# EAGLE design BRAIN_Breakout (EAGLE 6.5.0)
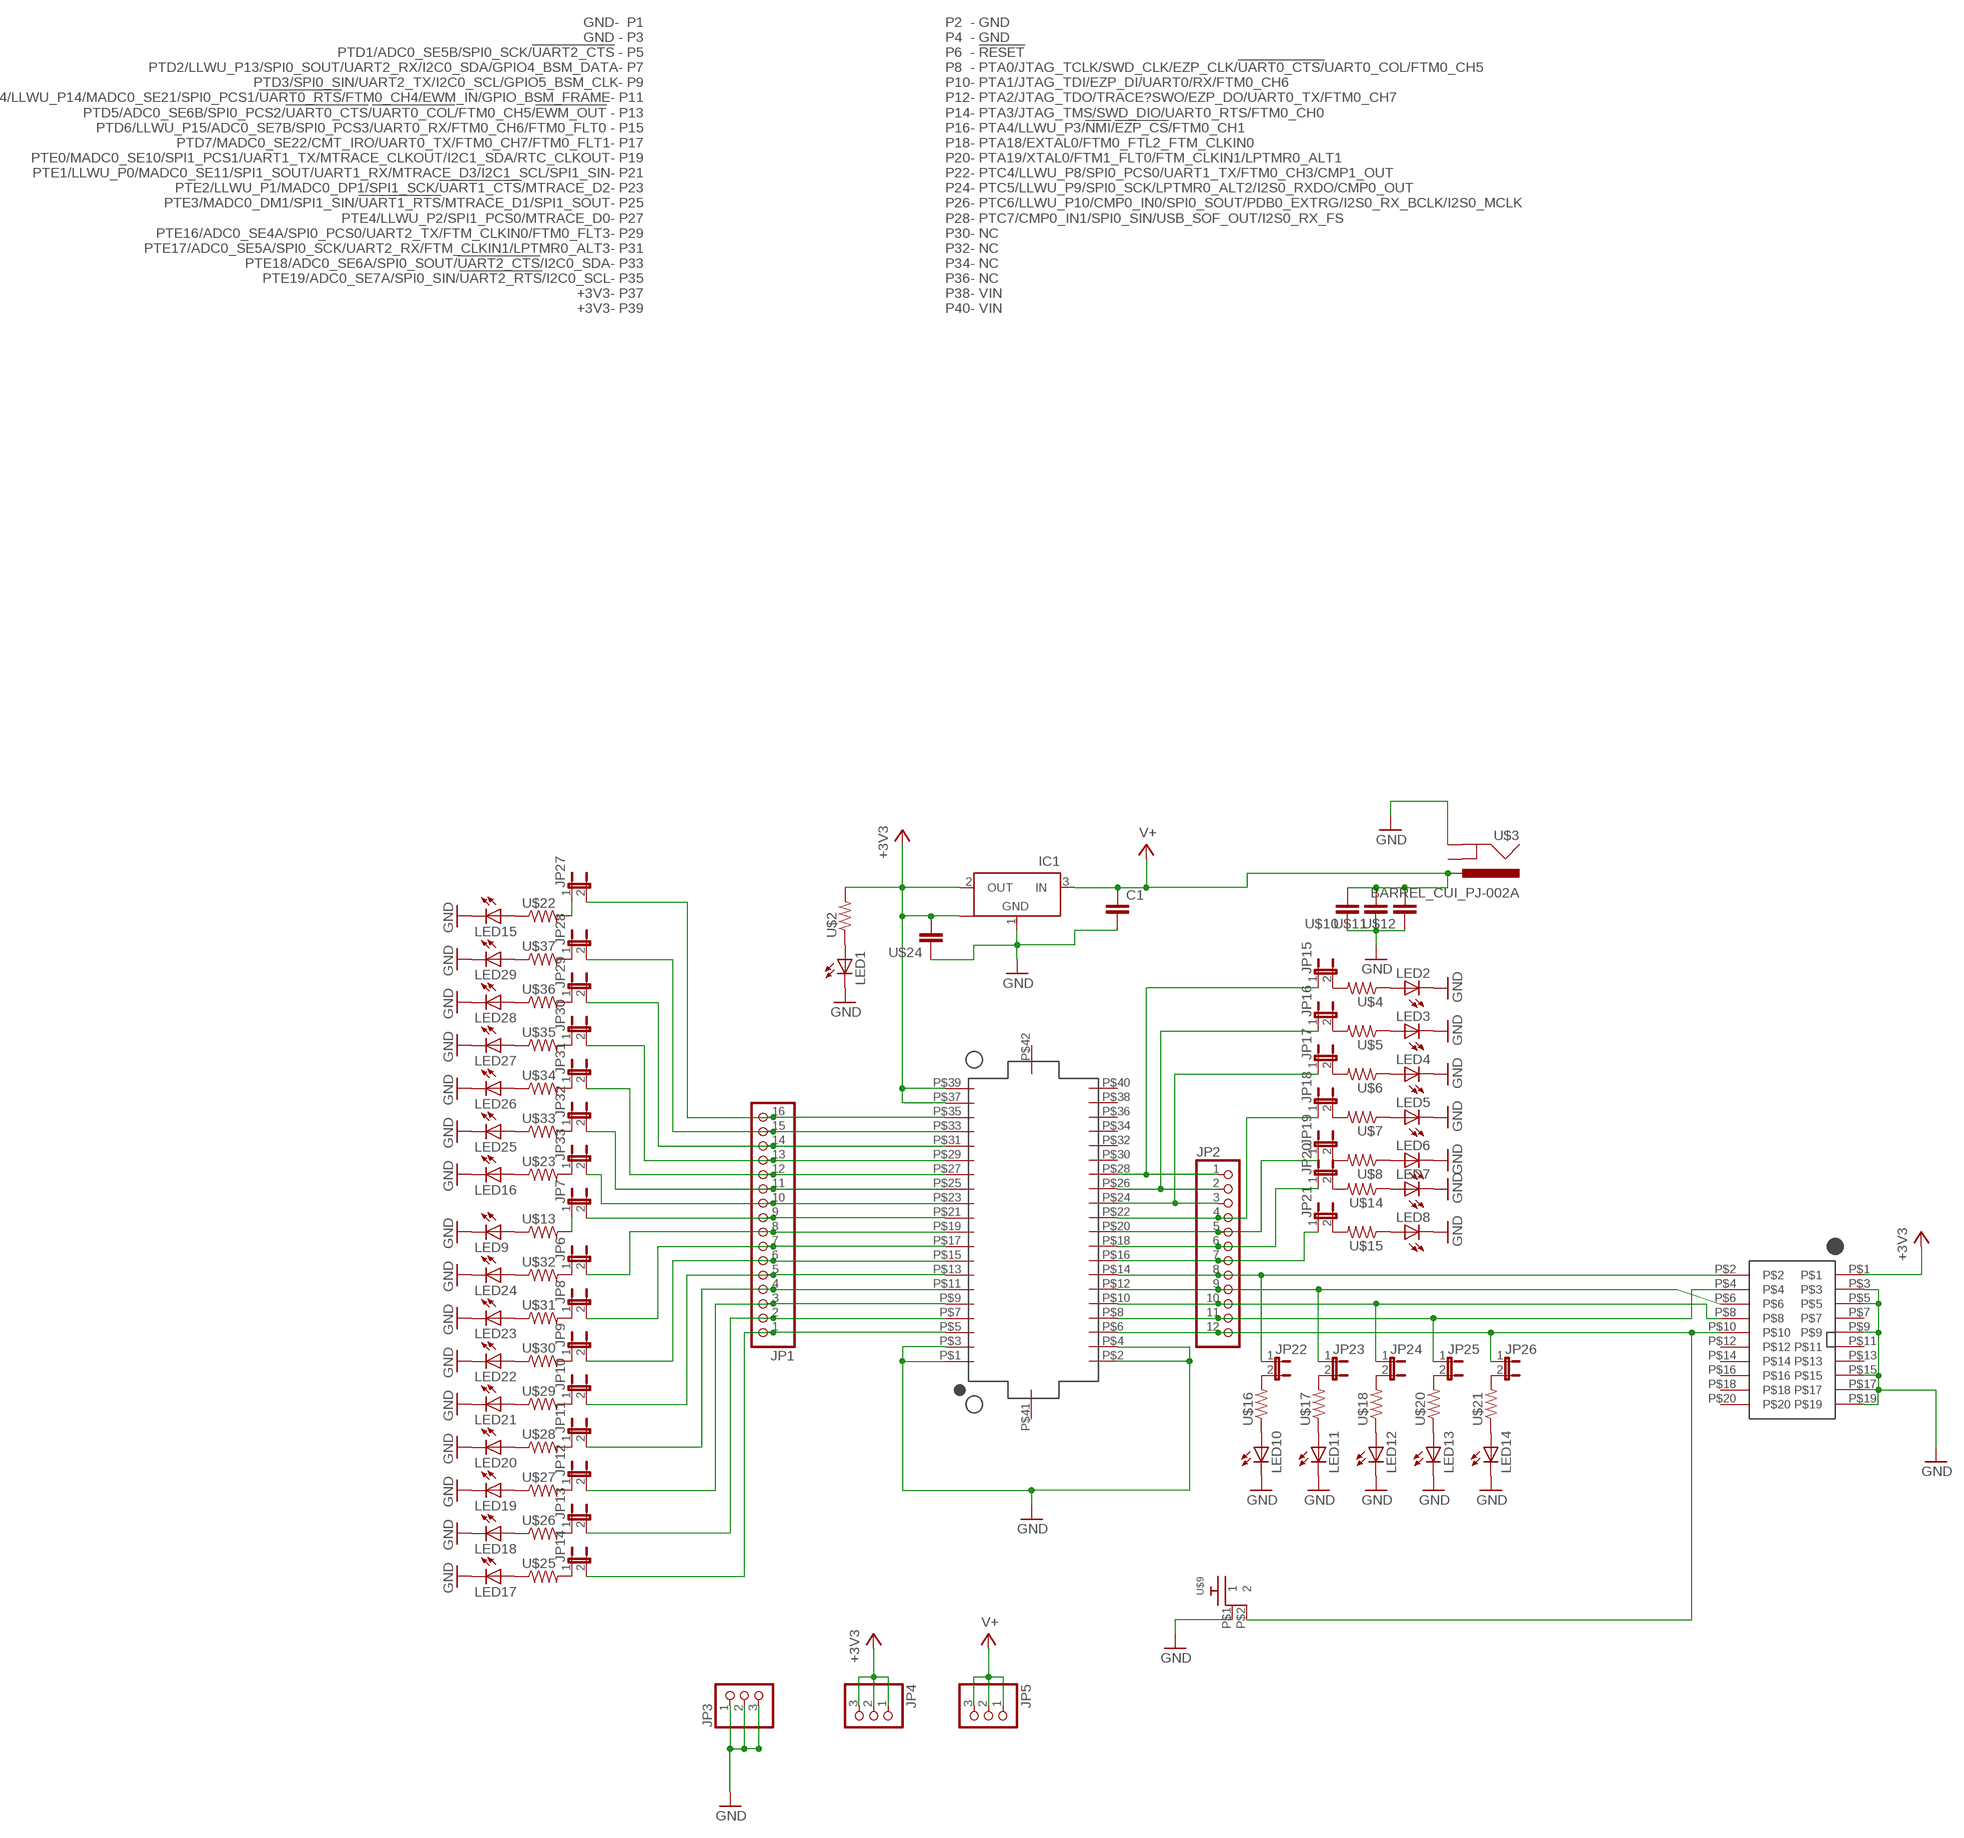
[diagram p0: schematic, sheet 1]

## Parts
C1  RF-C0805  [C0805]
IC1  NCP1117ST33T3G_1  [SOT223]
JP1  PINHD-1X16  [1X16]
JP2  PINHD-1X12  [1X12]
JP3  PINHD-1X3  [1X03]
JP4  PINHD-1X3  [1X03]
JP5  PINHD-1X3  [1X03]
JP6  JUMPER-2SMD-NO-NS  [SJ_2S-NO-NS]
JP7  JUMPER-2SMD-NO-NS  [SJ_2S-NO-NS]
JP8  JUMPER-2SMD-NO-NS  [SJ_2S-NO-NS]
JP9  JUMPER-2SMD-NO-NS  [SJ_2S-NO-NS]
JP10  JUMPER-2SMD-NO-NS  [SJ_2S-NO-NS]
JP11  JUMPER-2SMD-NO-NS  [SJ_2S-NO-NS]
JP12  JUMPER-2SMD-NO-NS  [SJ_2S-NO-NS]
JP13  JUMPER-2SMD-NO-NS  [SJ_2S-NO-NS]
JP14  JUMPER-2SMD-NO-NS  [SJ_2S-NO-NS]
JP15  JUMPER-2SMD-NO-NS  [SJ_2S-NO-NS]
JP16  JUMPER-2SMD-NO-NS  [SJ_2S-NO-NS]
JP17  JUMPER-2SMD-NO-NS  [SJ_2S-NO-NS]
JP18  JUMPER-2SMD-NO-NS  [SJ_2S-NO-NS]
JP19  JUMPER-2SMD-NO-NS  [SJ_2S-NO-NS]
JP20  JUMPER-2SMD-NO-NS  [SJ_2S-NO-NS]
JP21  JUMPER-2SMD-NO-NS  [SJ_2S-NO-NS]
JP22  JUMPER-2SMD-NO-NS  [SJ_2S-NO-NS]
JP23  JUMPER-2SMD-NO-NS  [SJ_2S-NO-NS]
JP24  JUMPER-2SMD-NO-NS  [SJ_2S-NO-NS]
JP25  JUMPER-2SMD-NO-NS  [SJ_2S-NO-NS]
JP26  JUMPER-2SMD-NO-NS  [SJ_2S-NO-NS]
JP27  JUMPER-2SMD-NO-NS  [SJ_2S-NO-NS]
JP28  JUMPER-2SMD-NO-NS  [SJ_2S-NO-NS]
JP29  JUMPER-2SMD-NO-NS  [SJ_2S-NO-NS]
JP30  JUMPER-2SMD-NO-NS  [SJ_2S-NO-NS]
JP31  JUMPER-2SMD-NO-NS  [SJ_2S-NO-NS]
JP32  JUMPER-2SMD-NO-NS  [SJ_2S-NO-NS]
JP33  JUMPER-2SMD-NO-NS  [SJ_2S-NO-NS]
LED1  LEDCHIP-LED0805  [CHIP-LED0805]
LED2  LEDCHIP-LED0805  [CHIP-LED0805]
LED3  LEDCHIP-LED0805  [CHIP-LED0805]
LED4  LEDCHIP-LED0805  [CHIP-LED0805]
LED5  LEDCHIP-LED0805  [CHIP-LED0805]
LED6  LEDCHIP-LED0805  [CHIP-LED0805]
LED7  LEDCHIP-LED0805  [CHIP-LED0805]
LED8  LEDCHIP-LED0805  [CHIP-LED0805]
LED9  LEDCHIP-LED0805  [CHIP-LED0805]
LED10  LEDCHIP-LED0805  [CHIP-LED0805]
LED11  LEDCHIP-LED0805  [CHIP-LED0805]
LED12  LEDCHIP-LED0805  [CHIP-LED0805]
LED13  LEDCHIP-LED0805  [CHIP-LED0805]
LED14  LEDCHIP-LED0805  [CHIP-LED0805]
LED15  LEDCHIP-LED0805  [CHIP-LED0805]
LED16  LEDCHIP-LED0805  [CHIP-LED0805]
LED17  LEDCHIP-LED0805  [CHIP-LED0805]
LED18  LEDCHIP-LED0805  [CHIP-LED0805]
LED19  LEDCHIP-LED0805  [CHIP-LED0805]
LED20  LEDCHIP-LED0805  [CHIP-LED0805]
LED21  LEDCHIP-LED0805  [CHIP-LED0805]
LED22  LEDCHIP-LED0805  [CHIP-LED0805]
LED23  LEDCHIP-LED0805  [CHIP-LED0805]
LED24  LEDCHIP-LED0805  [CHIP-LED0805]
LED25  LEDCHIP-LED0805  [CHIP-LED0805]
LED26  LEDCHIP-LED0805  [CHIP-LED0805]
LED27  LEDCHIP-LED0805  [CHIP-LED0805]
LED28  LEDCHIP-LED0805  [CHIP-LED0805]
LED29  LEDCHIP-LED0805  [CHIP-LED0805]
U$1  DF12_F  [DF12_F]
U$2  RF-R0805  [RF-C0805]
U$3  BARREL_CUI_PJ-002A  [BARREL_CUI_PJ-002A]
U$4  RF-R0805  [RF-C0805]
U$5  RF-R0805  [RF-C0805]
U$6  RF-R0805  [RF-C0805]
U$7  RF-R0805  [RF-C0805]
U$8  RF-R0805  [RF-C0805]
U$9  RA_BUTTON  [RA_BUTTON]
U$10  RF-C0805  [C0805]
U$11  RF-C0805  [C0805]
U$12  RF-C0805  [C0805]
U$13  RF-R0805  [RF-C0805]
U$14  RF-R0805  [RF-C0805]
U$15  RF-R0805  [RF-C0805]
U$16  RF-R0805  [RF-C0805]
U$17  RF-R0805  [RF-C0805]
U$18  RF-R0805  [RF-C0805]
U$19  2X10JTAG  [2X10JTAG]
U$20  RF-R0805  [RF-C0805]
U$21  RF-R0805  [RF-C0805]
U$22  RF-R0805  [RF-C0805]
U$23  RF-R0805  [RF-C0805]
U$24  RF-C0805  [C0805]
U$25  RF-R0805  [RF-C0805]
U$26  RF-R0805  [RF-C0805]
U$27  RF-R0805  [RF-C0805]
U$28  RF-R0805  [RF-C0805]
U$29  RF-R0805  [RF-C0805]
U$30  RF-R0805  [RF-C0805]
U$31  RF-R0805  [RF-C0805]
U$32  RF-R0805  [RF-C0805]
U$33  RF-R0805  [RF-C0805]
U$34  RF-R0805  [RF-C0805]
U$35  RF-R0805  [RF-C0805]
U$36  RF-R0805  [RF-C0805]
U$37  RF-R0805  [RF-C0805]

## Nets
+3V3: IC1.2(OUT) IC1.4(OUT1) JP4.1 JP4.2 JP4.3 U$1.P$37(+3V3) U$1.P$39(+3V3) U$2.2 U$19.P$1 U$24.2
GND: C1.2 IC1.1(GND) JP3.1 JP3.2 JP3.3 LED1.C LED2.C LED3.C LED4.C LED5.C LED6.C LED7.C LED8.C LED9.C LED10.C LED11.C LED12.C LED13.C LED14.C LED15.C LED16.C LED17.C LED18.C LED19.C LED20.C LED21.C LED22.C LED23.C LED24.C LED25.C LED26.C LED27.C LED28.C LED29.C U$1.P$1(GND) U$1.P$2(GND) U$1.P$3(GND) U$1.P$4(GND) U$3.P$2(GND) U$9.P$1 U$10.1 U$11.1 U$12.1 U$19.P$3 U$19.P$5 U$19.P$9 U$19.P$15 U$19.P$17 U$19.P$19 U$24.1
N$1: LED1.A U$2.1
N$2: LED2.A U$4.1
N$3: LED3.A U$5.1
N$4: LED4.A U$6.1
N$5: LED8.A U$15.1
N$6: LED5.A U$7.1
N$7: LED6.A U$8.1
N$8: LED7.A U$14.1
N$9: LED9.A U$13.1
N$10: JP7.1 U$13.2
N$11: JP21.2 U$15.2
N$12: JP20.2 U$14.2
N$13: JP19.2 U$8.2
N$14: JP18.2 U$7.2
N$15: JP17.2 U$6.2
N$16: JP16.2 U$5.2
N$17: JP15.2 U$4.2
N$18: JP6.1 U$32.2
N$19: JP8.1 U$31.2
N$20: JP9.1 U$30.2
N$21: JP2.1 JP15.1 U$1.P$28(PTC7/CMP0_IN1/SPI0_SIN/USB_SOF_OUT/I2S0_RX_FS)
N$22: JP2.2 JP16.1 U$1.P$26(PTC6/LLWU_P10/CMP0_IN0/SPI0_SOUT/PDB0_EXTRG/I2S0_RX_BCLK/I2S0_MCLK)
N$23: JP2.3 JP17.1 U$1.P$24(PTC5/LLWU_P8/SPI0_PCS0/UART1_TX/FTM0_CH3/CMP1_OUT)
N$24: JP2.4 JP18.1 U$1.P$22(PTC4/LLWU_P8/SPI0_PCS0/UART1_TX/FTM0_CH3/CMP1_OUT)
N$25: JP2.5 JP19.1 U$1.P$20(PTA19/XTAL0/FTM1_FLT0/FTM_CLKIN1/LPTMR0_ALT1)
N$26: JP2.6 JP20.1 U$1.P$18(PTA18/EXTAL0/FTM0_FTL2_FTM_CLKIN0)
N$27: JP2.7 JP21.1 U$1.P$16(PTA4/LLWU_P3/!NMI!/!EZP_CS!/FTM0_CH1)
N$28: LED15.A U$22.1
N$29: LED17.A U$25.1
N$30: LED18.A U$26.1
N$31: LED19.A U$27.1
N$32: LED20.A U$28.1
N$33: LED16.A U$23.1
N$34: LED25.A U$33.1
N$35: LED26.A U$34.1
N$36: LED27.A U$35.1
N$37: LED21.A U$29.1
N$38: LED22.A U$30.1
N$39: LED23.A U$31.1
N$40: LED24.A U$32.1
N$41: JP10.1 U$29.2
N$42: JP11.1 U$28.2
N$43: JP14.1 U$25.2
N$44: JP13.1 U$26.2
N$45: JP12.1 U$27.2
N$46: LED28.A U$36.1
N$48: JP2.8 JP22.1 U$1.P$14(PTA3/JTAG_TMS/SWD_DIO/UART0_RTS/FTM0_CH0) U$19.P$2
N$49: LED10.A U$16.1
N$50: JP22.2 U$16.2
N$51: JP2.9 JP23.1 U$1.P$12(PTA2/JTAG_TDO/TRACE?SWO/EZP_DO/UART0_TX/FTM0_CH7) U$19.P$6
N$52: LED11.A U$17.1
N$53: JP23.2 U$17.2
N$54: JP2.10 JP24.1 U$1.P$10(PTA1/JTAG_TDI/EZP_DI/UART0/RX/FTM0_CH6) U$19.P$8
N$55: LED12.A U$18.1
N$56: JP24.2 U$18.2
N$57: JP2.11 JP25.1 U$1.P$8(PTA0/JTAG_TCLK/SWD_CLK/EZP_CLK/!UART0_CTS/!UART0_COL/FTM0_CH5) U$19.P$4
N$58: LED13.A U$20.1
N$59: JP25.2 U$20.2
N$60: JP2.12 JP26.1 U$1.P$6(!RESET) U$9.P$2 U$19.P$10
N$61: LED14.A U$21.1
N$62: JP26.2 U$21.2
N$63: LED29.A U$37.1
N$64: JP27.1 U$22.2
N$65: JP28.1 U$37.2
N$66: JP29.1 U$36.2
N$67: JP30.1 U$35.2
N$68: JP31.1 U$34.2
N$69: JP32.1 U$33.2
N$70: JP33.1 U$23.2
PTD1: JP1.1 JP14.2 U$1.P$5(PTD1/ADC0_SE5B/SPI0_SCK/!UART2_CTS)
PTD2: JP1.2 JP13.2 U$1.P$7(PTD2/LLWU_P13/SPI0_SOUT/UART2_RX/I2C0_SDA/GPIO4_BSM_DATA)
PTD3: JP1.3 JP12.2 U$1.P$9(PTD3/SPI0_SIN/UART2_TX/I2C0_SCL/GPIO5_BSM_CLK)
PTD4: JP1.4 JP11.2 U$1.P$11(PTD4/LLWU_P14/MADC0_SE21/SPI0_PCS1/!UART0_RTS!/FTM0_CH4/EWM_IN/GPIO_BSM_FRAME)
PTD5: JP1.5 JP10.2 U$1.P$13(PTD5/ADC0_SE6B/SPI0_PCS2/!UART0_CTS!/!UART0_COL!/FTM0_CH5/!EWM_OUT)
PTD6: JP1.6 JP9.2 U$1.P$15(PTD6/LLWU_P15/ADC0_SE7B/SPI0_PCS3/UART0_RX/FTM0_CH6/FTM0_FLT0)
PTD7: JP1.7 JP8.2 U$1.P$17(PTD7/MADC0_SE22/CMT_IRO/UART0_TX/FTM0_CH7/FTM0_FLT1)
PTE0: JP1.8 JP6.2 U$1.P$19(PTE0/MADC0_SE10/SPI1_PCS1/UART1_TX/MTRACE_CLKOUT/I2C1_SDA/RTC_CLKOUT)
PTE1: JP1.9 JP7.2 U$1.P$21(PTE1/LLWU_P0/MADC0_SE11/SPI1_SOUT/UART1_RX/MTRACE_D3/I2C1_SCL/SPI1_SIN)
PTE2: JP1.10 JP33.2 U$1.P$23(PTE2/LLWU_P1/MADC0_DP1/SPI1_SCK/!UART1_CTS!/MTRACE_D2)
PTE3: JP1.11 JP32.2 U$1.P$25(PTE3/MADC0_DM1/SPI1_SIN/!UART1_RTS!/MTRACE_D1/SPI1_SOUT)
PTE4: JP1.12 JP31.2 U$1.P$27(PTE4/LLWU_P2/SPI1_PCS0/MTRACE_D0)
PTE16: JP1.13 JP30.2 U$1.P$29(PTE16/ADC0_SE4A/SPI0_PCS0/UART2_TX/FTM_CLKIN0/FTM0_FLT3)
PTE17: JP1.14 JP29.2 U$1.P$31(PTE17/ADC0_SE5A/SPI0_SCK/UART2_RX/FTM_CLKIN1/LPTMR0_ALT3)
PTE18: JP1.15 JP28.2 U$1.P$33(PTE18/ADC0_SE6A/SPI0_SOUT/!UART2_CTS!/I2C0_SDA)
PTE19: JP1.16 JP27.2 U$1.P$35(PTE19/ADC0_SE7A/SPI0_SIN/!UART2_RTS!/I2C0_SCL)
V+: C1.1 IC1.3(IN) JP5.1 JP5.2 JP5.3 U$3.P$1(PWR) U$10.2 U$11.2 U$12.2
Unconnected: U$1.P$30(NC) U$1.P$32(NC) U$1.P$34(NC) U$1.P$36(NC) U$1.P$38(VIN) U$1.P$40(VIN) U$1.P$41 U$1.P$42 U$3.P$3(GNDBREAK) U$19.P$7 U$19.P$11 U$19.P$12 U$19.P$13 U$19.P$14 U$19.P$16 U$19.P$18 U$19.P$20

## Library data of the parts
C1 U$10-U$12 U$24 = GW-devices:RF-C: RF capacitor pads for FSL reference design
IC1 = KW2:NCP1117ST33T3G_1: VOLTAGE REGULATOR; MFGN: OnSemi; MFGP: NCP1117ST33T3G
JP1 = pinhead:PINHD-1X16: PIN HEADER
JP2 = pinhead:PINHD-1X12: PIN HEADER
JP3-JP5 = pinhead:PINHD-1X3: PIN HEADER
JP6-JP33 = SparkFun:JUMPER-2: Jumper Basic 0.1" spaced jumper. Use with breakaway headers.
LED1-LED14 LED16-LED27 LED29 = adafruit:LED: LED OSRAM: - CHIPLED LG R971, LG N971, LY N971, LG Q971, LY Q971, LO R971, LY R971 LH N974, LH R974 LS Q976, LO Q976, LY Q976 LO Q996 - Hyper CHIPLED LW Q18S LB Q993, LB Q99A, LB R99A - SideLED LS A670, LO A670, LY A670, LG A670, LP A670 LB A673, LV A673, LT A673, LW A673 LH A674 LY A675 LS A676, LA A676, LO A676, LY A676, LW A676 LS A679, LY A679, LG A679 - Hyper Micro SIDELED® LS Y876, LA Y876, LO Y876, LY Y876 LT Y87S - SmartLED LW L88C, LW L88S LB L89C, LB L89S, LG L890 LS L89K, LO L89K, LY L89K LS L896, LA L896, LO L896, LY L896 - TOPLED LS T670, LO T670, LY T670, LG T670, LP T670 LSG T670, LSP T670, LSY T670, LOP T670, LYG T670 LG T671, LOG T671, LSG T671 LB T673, LV T673, LT T673, LW T673 LH T674 LS T676, LA T676, LO T676, LY T676, LB T676, LH T676, LSB T676, LW T676 LB T67C, LV T67C, LT T67C, LS T67K, LO T67K, LY T67K, LW E67C LS E67B, LA E67B, LO E67B, LY E67B, LB E67C, LV E67C, LT E67C LW T67C LS T679, LY T679, LG T679 LS T770, LO T770, LY T770, LG T770, LP T770 LB T773, LV T773, LT T773, LW T773 LH T774 LS E675, LA E675, LY E675, LS T675 LS T776, LA T776, LO T776, LY T776, LB T776 LHGB T686 LT T68C, LB T68C - Hyper Mini TOPLED® LB M676 - Mini TOPLED Santana® LG M470 LS M47K, LO M47K, LY M47K Source: http://www.osram.convergy.de/
LED15 LED28 = adafruit:LED: LED OSRAM: - CHIPLED LG R971, LG N971, LY N971, LG Q971, LY Q971, LO R971, LY R971 LH N974, LH R974 LS Q976, LO Q976, LY Q976 LO Q996 - Hyper CHIPLED LW Q18S LB Q993, LB Q99A, LB R99A - SideLED LS A670, LO A670, LY A670, LG A670, LP A670 LB A673, LV A673, LT A673, LW A673 LH A674 LY A675 LS A676, LA A676, LO A676, LY A676, LW A676 LS A679, LY A679, LG A679 - Hyper Micro SIDELED® LS Y876, LA Y876, LO Y876, LY Y876 LT Y87S - SmartLED LW L88C, LW L88S LB L89C, LB L89S, LG L890 LS L89K, LO L89K, LY L89K LS L896, LA L896, LO L896, LY L896 - TOPLED LS T670, LO T670, LY T670, LG T670, LP T670 LSG T670, LSP T670, LSY T670, LOP T670, LYG T670 LG T671, LOG T671, LSG T671 LB T673, LV T673, LT T673, LW T673 LH T674 LS T676, LA T676, LO T676, LY T676, LB T676, LH T676, LSB T676, LW T676 LB T67C, LV T67C, LT T67C, LS T67K, LO T67K, LY T67K, LW E67C LS E67B, LA E67B, LO E67B, LY E67B, LB E67C, LV E67C, LT E67C LW T67C LS T679, LY T679, LG T679 LS T770, LO T770, LY T770, LG T770, LP T770 LB T773, LV T773, LT T773, LW T773 LH T774 LS E675, LA E675, LY E675, LS T675 LS T776, LA T776, LO T776, LY T776, LB T776 LHGB T686 LT T68C, LB T68C - Hyper Mini TOPLED® LB M676 - Mini TOPLED Santana® LG M470 LS M47K, LO M47K, LY M47K Source: http://www.osram.convergy.de/; MFGN: Kingbright
U$1 = KW2:DF12_F
U$2 U$4-U$8 U$13-U$18 U$20-U$23 U$25-U$37 = GW-devices:RF-R: RF resistor pads for FSL reference design
U$3 = KW2:BARREL_CUI_PJ-002A
U$9 = KW2:RA_BUTTON; MFGN: TE; MFGP: 1825027-5
U$19 = KW2:2X10JTAG

## Board
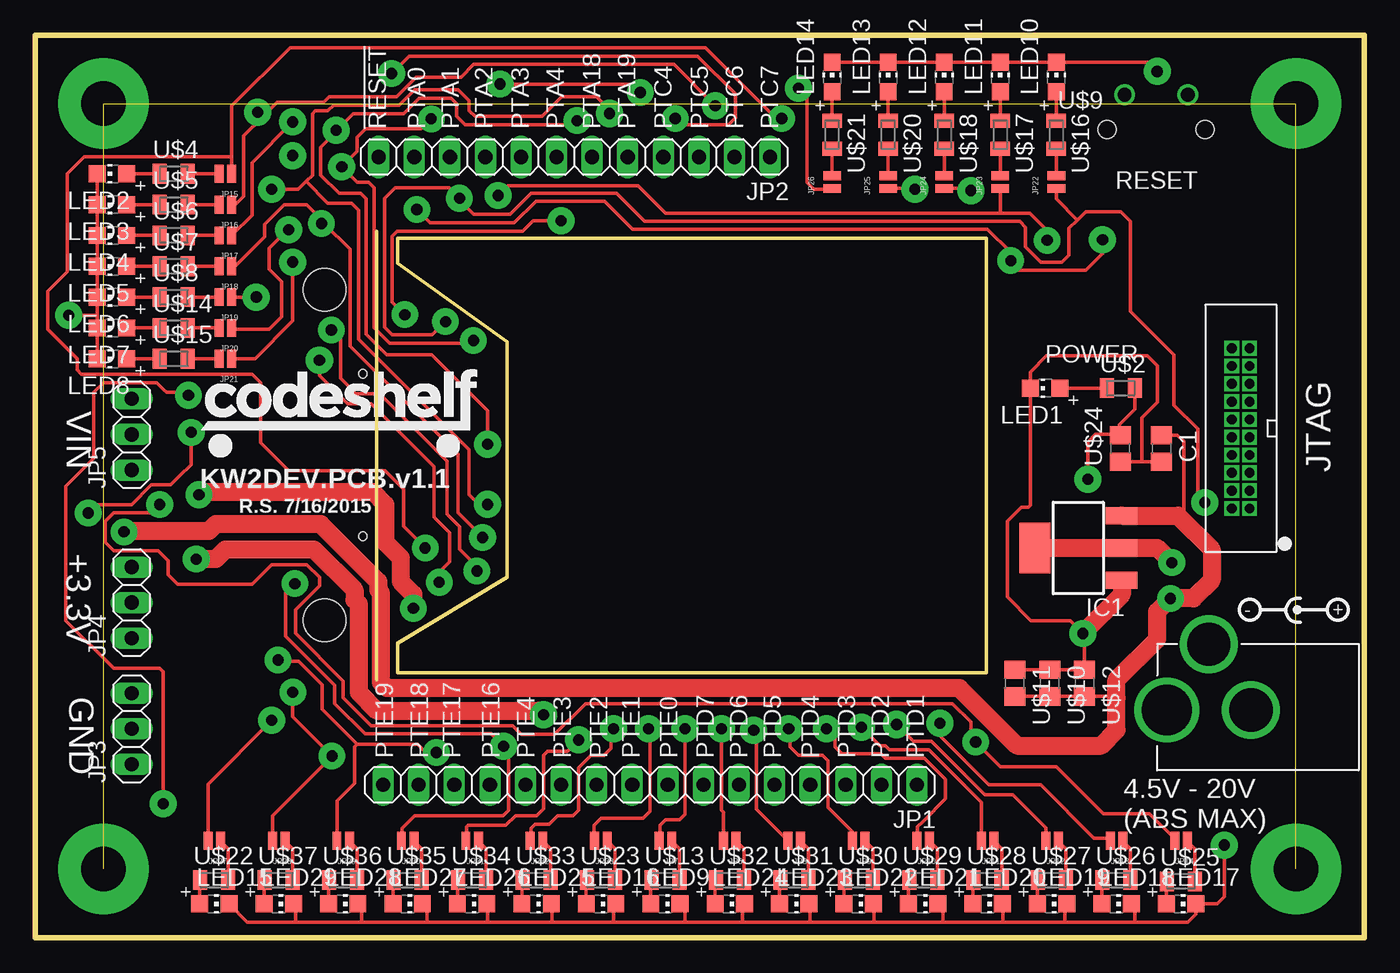
[diagram p1: board, top side]
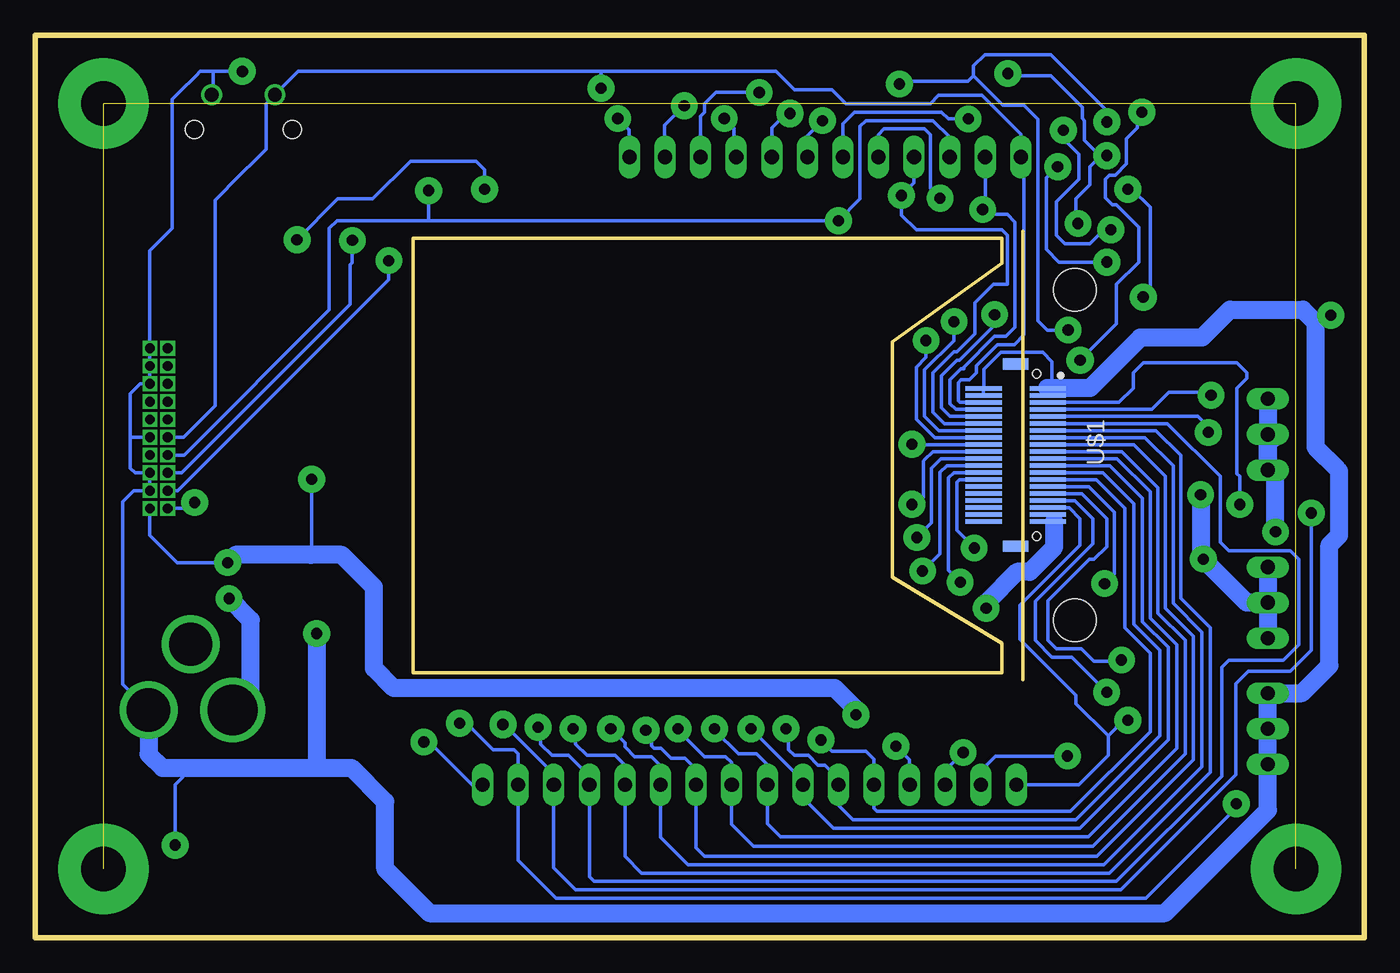
[diagram p2: board, bottom side, seen from below]

Size 94.9 x 64.4 mm. Coordinates in mm from the lower left corner, seen from the top.
Outline: 0,64.4 94.9,64.4 94.9,0 0,0 0,64.4
Copper layers (1*16): Top 0.035mm / dielectric 1.5mm / Bottom 0.035mm
Design rules "default *": minimum track width 10mil, minimum drill 0.8mm, track to track 0.25mm, track to pad 0.25mm, pad to pad 0.25mm, via to via 0.25mm, smd to smd 0.25mm, copper to edge 0.1mm, drill to drill 0.1mm, minimum pad ring 0.1mm, minimum via ring 0.55mm, stop-mask expansion 4mil, vias tented up to drill 0.8mm, thermal gap 10mil

### Footprints (pad centres in the part's own frame; a part is rotated, then mirrored left to right if it is on the bottom)
C0805 = smd 1.3 x 1.5: 1 -0.95,0; 2 0.95,0
SOT223 = smd 1.219 x 2.235: 1 -2.311,-3.099; 2 0,-3.099; 3 2.311,-3.099 | smd 3.6 x 2.2: 4 0,3.099
1X16 = drill 1.016 long: 1 -19.05,0; 2 -16.51,0; 3 -13.97,0; 4 -11.43,0; 5 -8.89,0; 6 -6.35,0; 7 -3.81,0; 8 -1.27,0; 9 1.27,0; 10 3.81,0; 11 6.35,0; 12 8.89,0; 13 11.43,0; 14 13.97,0; 15 16.51,0; 16 19.05,0
1X12 = drill 1.016 long: 1 -13.97,0; 2 -11.43,0; 3 -8.89,0; 4 -6.35,0; 5 -3.81,0; 6 -1.27,0; 7 1.27,0; 8 3.81,0; 9 6.35,0; 10 8.89,0; 11 11.43,0; 12 13.97,0
1X03 = drill 1.016 long: 1 -2.54,0; 2 0,0; 3 2.54,0
SJ_2S-NO-NS = smd 0.635 x 1.27: 1 -0.45,0; 2 0.45,0
CHIP-LED0805 = smd 1.2 x 1.2: A 0,-1.05; C 0,1.05
DF12_F = smd 0.3 x 2.6: P$1 -4.75,2.3; P$2 -4.75,-2.3; P$3 -4.25,2.3; P$4 -4.25,-2.3; P$5 -3.75,2.3; P$6 -3.75,-2.3; P$7 -3.25,2.3; P$8 -3.25,-2.3; P$9 -2.75,2.3; P$10 -2.75,-2.3; P$11 -2.25,2.3; P$12 -2.25,-2.3; P$13 -1.75,2.3; P$14 -1.75,-2.3; P$15 -1.25,2.3; P$16 -1.25,-2.3; P$17 -0.75,2.3; P$18 -0.75,-2.3; P$19 -0.25,2.3; P$20 -0.25,-2.3; P$21 0.25,2.3; P$22 0.25,-2.3; P$23 0.75,2.3; P$24 0.75,-2.3; P$25 1.25,2.3; P$26 1.25,-2.3; P$27 1.75,2.3; P$28 1.75,-2.3; P$29 2.25,2.3; P$30 2.25,-2.3; P$31 2.75,2.3; P$32 2.75,-2.3; P$33 3.25,2.3; P$34 3.25,-2.3; P$35 3.75,2.3; P$36 3.75,-2.3; P$37 4.25,2.3; P$38 4.25,-2.3; P$39 4.75,2.3; P$40 4.75,-2.3 | smd 0.8 x 1.8: P$41 -6.5,0; P$42 6.5,0 | hole 0.6: -5.8,1.5; 5.8,1.5 | hole 3.048: -11.8,4.24; 11.8,4.24
RF-C0805 = smd 1 x 1.4: 1 -1,0; 2 1,0
BARREL_CUI_PJ-002A = drill 3.6: P$1 0,0 | drill 3.1: P$2 6,0; P$3 3,4.7
RA_BUTTON = drill 0.99: P$1 -2.25,0; P$2 2.25,0 | hole 1.3: -3.501,2.49; 3.501,2.49
2X10JTAG = drill 0.7 pad 1 square: P$1 -6.35,-1.27; P$2 -6.35,0; P$3 -5.08,-1.27; P$4 -5.08,0; P$5 -3.81,-1.27; P$6 -3.81,0; P$7 -2.54,-1.27; P$8 -2.54,0; P$9 -1.27,-1.27; P$10 -1.27,0; P$11 0,-1.27; P$12 0,0; P$13 1.27,-1.27; P$14 1.27,0; P$15 2.54,-1.27; P$16 2.54,0; P$17 3.81,-1.27; P$18 3.81,0; P$19 5.08,-1.27; P$20 5.08,0

### Placement (x,y rotation side)
C1  80.4,34.9 270 top
IC1  74.47,27.8 90 top
JP1  43.9,10.9 180 top
JP2  38.5,55.7 180 top
JP3  6.9,14.9 90 top
JP4  6.9,23.9 90 top
JP5  6.9,35.9 90 top
JP6  49.6,6.9 180 top
JP7  45,6.9 180 top
JP8  54.2,6.9 180 top
JP9  58.8,6.9 180 top
JP10  63.4,6.9 180 top
JP11  68,6.9 180 top
JP12  72.6,6.9 180 top
JP13  77.2,6.9 180 top
JP14  81.8,6.9 180 top
JP15  13.6,54.5 180 top
JP16  13.6,52.3 180 top
JP17  13.6,50.1 180 top
JP18  13.6,47.9 180 top
JP19  13.6,45.7 180 top
JP20  13.6,43.5 180 top
JP21  13.6,41.3 180 top
JP22  72.9,53.9 90 top
JP23  68.9,53.9 90 top
JP24  64.9,53.9 90 top
JP25  60.9,53.9 90 top
JP26  56.9,53.9 90 top
JP27  12.8,6.9 180 top
JP28  17.4,6.9 180 top
JP29  22,6.9 180 top
JP30  26.6,6.9 180 top
JP31  31.2,6.9 180 top
JP32  35.8,6.9 180 top
JP33  40.4,6.9 180 top
LED1  72.1,39.2 90 top
LED2  5.5,54.5 90 top
LED3  5.5,52.3 90 top
LED4  5.5,50.1 90 top
LED5  5.5,47.9 90 top
LED6  5.5,45.7 90 top
LED7  5.5,43.5 90 top
LED8  5.5,41.3 90 top
LED9  45,2.4 270 top
LED10  72.9,61.4 0 top
LED11  68.9,61.4 0 top
LED12  64.9,61.4 0 top
LED13  60.9,61.4 0 top
LED14  56.9,61.4 0 top
LED15  12.8,2.4 270 top
LED16  40.4,2.4 270 top
LED17  81.8,2.4 270 top
LED18  77.2,2.4 270 top
LED19  72.6,2.4 270 top
LED20  68,2.4 270 top
LED21  63.4,2.4 270 top
LED22  58.8,2.4 270 top
LED23  54.2,2.4 270 top
LED24  49.6,2.4 270 top
LED25  35.8,2.4 270 top
LED26  31.2,2.4 270 top
LED27  26.6,2.4 270 top
LED28  22,2.4 270 top
LED29  17.4,2.4 270 top
U$1  24.9,34.43 270 bottom
U$2  77.5,39.2 0 top
U$3  80.79,16.23 0 top
U$4  9.9,54.5 0 top
U$5  9.9,52.3 0 top
U$6  9.9,50.1 0 top
U$7  9.9,47.9 0 top
U$8  9.9,45.7 0 top
U$9  80.03,60.14 180 top
U$10  72.43,18.15 270 top
U$11  69.94,18.15 270 top
U$12  74.92,18.15 270 top
U$13  45,4.1 0 top
U$14  9.9,43.5 0 top
U$15  9.9,41.3 0 top
U$16  72.9,57.3 270 top
U$17  68.9,57.3 270 top
U$18  64.9,57.3 270 top
U$19  85.43,36.97 90 top
U$20  60.9,57.3 270 top
U$21  56.9,57.3 270 top
U$22  12.8,4.1 0 top
U$23  40.4,4.1 0 top
U$24  77.46,34.9 90 top
U$25  81.8,4 0 top
U$26  77.2,4.1 0 top
U$27  72.6,4.1 0 top
U$28  68,4.1 0 top
U$29  63.4,4.1 0 top
U$30  58.8,4.1 0 top
U$31  54.2,4.1 0 top
U$32  49.6,4.1 0 top
U$33  35.8,4.1 0 top
U$34  31.2,4.1 0 top
U$35  26.6,4.1 0 top
U$36  22,4.1 0 top
U$37  17.4,4.1 0 top

### Tracks (layer width: path | path; a pad name or v marks a point on that pad's centre or on a via)
+3V3  (via drill 0.8)
  Top 0.254: U$2.2 78.5,37.7 77.4,36.6 77.4,35.91 U$24.2 77.41,35.9 75.7,35.9 75.15,35.35 v75.15,32.7
  Top 1.27: v11.5,27 12.9,27 13.6,27.7 19.9,27.7 22.8,24.8 22.8,24.1 23.1,23.8 23.1,17.5 24.4,16.2 36,16.2 v36.3,15.9 | v81.15,26.75 80.1,27.8 IC1.2 IC1.4 | v11.7,31.6 11.9,31.8 24.1,31.8 25,30.9 25,28.2 26.1,27.1 26.1,25.4 27,24.5 v27,23.5
  Bottom 0.254: U$1.P$37 U$1.P$39 22.58,29.7 22.15,29.7 | 80.97,26.88 81.03,26.88 v81.15,26.75 84.75,26.75 86.7,28.7 U$19.P$1 | v75.15,32.7 75.15,27.35 75.2,27.3
  Bottom 1.27: 81.05,26.8 80.97,26.88 | 22.15,29.7 22.15,27.85 23.9,26.1 24.8,26.1 27,23.9 v27,23.5 | JP4.3 JP4.2 | JP4.2 JP4.1 | v81.15,26.75 80.6,27.3 75.2,27.3 73,27.3 70.7,25 70.7,19.2 69.3,17.8 37.8,17.8 36.3,16.3 v36.3,15.9 | JP4.2 8.4,23.9 v11.5,27 11.7,27.2 v11.7,31.6
GND  (via drill 0.8, 0.8 pad 1.93)
  Top 0.254: U$24.1 79,33.95 | 79,33.95 C1.2 | U$11.1 U$10.1 U$12.1 74.92,21.58 v74.8,21.7 73.9,22.6 71.1,22.6 69.4,24.3 69.4,29.7 70.4,30.7 70.9,30.7 71.05,30.85 LED1.C 71.05,40.35 72.2,41.5 79.4,41.5 80.1,40.8 80.1,38.2 79,37.1 79,33.95 | LED14.C LED13.C LED12.C LED11.C LED10.C 75.95,62.45 79.45,62.45 v80.1,61.8 | v2.4,44.4 4.45,44.4 | LED2.C LED3.C LED4.C LED5.C LED6.C 4.45,44.4 | 4.45,44.4 LED7.C LED8.C | LED15.C 15.15,1.1 18.6,1.1 | 18.6,1.1 23.3,1.1 | 23.3,1.1 28,1.1 | 28,1.1 32.3,1.1 | 32.3,1.1 36.9,1.1 | 36.9,1.1 41.3,1.1 | 41.3,1.1 46.4,1.1 | 46.4,1.1 50.5,1.1 | 50.5,1.1 55.3,1.1 | 55.3,1.1 59.9,1.1 | 59.9,1.1 64.8,1.1 | 64.8,1.1 69.1,1.1 | 69.1,1.1 73.5,1.1 | 73.5,1.1 78.5,1.1 | 78.5,1.1 82.3,1.1 82.85,1.65 LED17.C 84.4,2.4 84.9,2.9 v84.9,6.6 | LED18.C 78.5,2.15 78.5,1.1 | LED19.C 73.5,2.25 73.5,1.1 | LED20.C 69.1,2.35 69.1,1.1 | LED21.C 64.8,2.05 64.8,1.1 | LED22.C 59.9,2.35 59.9,1.1 | LED23.C 55.3,2.35 55.3,1.1 | LED24.C 50.5,2.25 50.5,1.1 | LED9.C 46.4,2.05 46.4,1.1 | LED16.C 41.3,2.25 41.3,1.1 | LED25.C 36.9,2.35 36.9,1.1 | LED26.C 32.3,2.35 32.3,1.1 | LED29.C 18.6,2.25 18.6,1.1 | LED28.C 23.3,2.15 23.3,1.1 | LED27.C 28,2.05 28,1.1
  Top 1.27: IC1.1 77.57,24.47 v74.8,21.7
  Bottom 0.254: U$1.P$4 U$1.P$2 27.15,39.23 27.15,40.55 25.95,41.75 22.95,41.75 22.3,41.1 22.3,39.48 U$1.P$1 | U$1.P$3 U$1.P$1 | U$1.P$1 22.65,39.23 | 3.5,43.9 2.9,43.9 v2.4,44.4 | U$3.P$2 88.65,18.09 88.65,31.1 87.86,31.89 U$19.P$3 U$19.P$5 87.76,33.16 88.1,33.5 88.1,35.6 | 83.2,11.9 83.4,12.1 | U$19.P$9 88,35.7 88.1,35.6 | 88.1,35.6 88.1,38.8 87.4,39.5 U$19.P$15 U$19.P$17 U$19.P$19 86.7,49 85.1,50.6 85.1,56.2 85.1,59.8 84.6,60.3 83.4,61.5 83.1,61.8 82.2,61.8 | 83.7,12.1 84.9,10.9 v84.9,6.6 | 82.2,61.8 v80.1,61.8 | U$9.P$1 82.2,60.22 82.2,61.8
  Bottom 1.016: 1.8,33.3 1.95,33.45
  Bottom 1.27: 22.65,39.23 19.57,39.23 16,42.8 11.6,42.8 9.6,44.8 4.4,44.8 3.5,43.9 3.5,35 1.95,33.45 | U$3.P$2 86.79,13.09 85.8,12.1 83.7,12.1 83.4,12.1 74.7,12.1 | 74.7,12.1 72.31,12.1 69.9,9.69 69.9,4.9 66.75,1.75 14.25,1.75 6.9,9.1 JP3.1 JP3.2 JP3.3 4.46,17.44 2.5,19.4 2.5,28 1.8,28.7 1.8,33.3 | v74.8,21.7 74.8,12.2 74.7,12.1
N$1
  Top 0.254: LED1.A U$2.1
N$2
  Top 0.254: LED2.A U$4.1
N$3
  Top 0.254: LED3.A U$5.1
N$4
  Top 0.254: LED4.A U$6.1
N$5
  Top 0.254: LED8.A U$15.1
N$6
  Top 0.254: LED5.A U$7.1
N$7
  Top 0.254: LED6.A U$8.1
N$8
  Top 0.254: LED7.A U$14.1
N$9
  Top 0.254: U$13.1 43.95,4.05 LED9.A
N$10
  Top 0.254: U$13.2 46,5.35 46,6.35 JP7.1
N$11
  Top 0.254: U$15.2 JP21.2
N$12
  Top 0.254: U$14.2 JP20.2
N$13
  Top 0.254: U$8.2 JP19.2
N$14
  Top 0.254: U$7.2 JP18.2
N$15
  Top 0.254: U$6.2 JP17.2
N$16
  Top 0.254: U$5.2 JP16.2
N$17
  Top 0.254: U$4.2 JP15.2
N$18
  Top 0.254: U$32.2 50.6,5.35 50.6,6.35 JP6.1
N$19
  Top 0.254: U$31.2 55.2,5.35 55.2,6.35 JP8.1
N$20
  Top 0.254: U$30.2 59.8,5.35 59.8,6.35 JP9.1
N$21  (via drill 0.8)
  Top 0.254: v27.85,27.8 26.3,29.35 26.3,32 25,33.3 18.1,33.3 16.1,35.3 16.1,39.6 15.5,40.2 3.3,40.2 3,40.5 3,41.3 0.9,43.4 0.9,46.1 2.3,47.5 2.3,54.5 3.5,55.7 14.05,55.7 | JP15.1 14.05,55.7 | 14.05,55.7 14.05,59.35 18.2,63.5 47.85,63.5 52.5,58.85 52.9,58.85 v53.3,58.45
  Bottom 0.254: U$1.P$28 28.92,32.68 29.1,32.5 29.1,29.05 v27.85,27.8 | JP2.1 52.5,55.73 52.5,57.65 v53.3,58.45
N$22  (via drill 0.8, 0.8 pad 1.93)
  Top 0.254: v28.85,25.35 28.85,26.05 29.6,26.8 29.6,28.9 28.5,30 28.5,33.6 24,38.1 22.3,38.1 20.3,40.1 v20.3,41.2 | 16.25,58.55 14.9,57.2 14.9,52.9 14.3,52.3 JP16.1 | 16.25,58.55 17.3,59.6 20.6,59.6 21,60 25.8,60 27.2,61.4 30.4,61.4 31.3,62.3 45.6,62.3 v48.55,59.35 | v15.9,58.9 16.25,58.55
  Bottom 0.254: U$1.P$26 29.32,33.18 29.7,32.8 29.7,26.2 v28.85,25.35 | JP2.2 49.95,55.72 49.95,57.95 v48.55,59.35 | v15.9,58.9 16.2,58.6 16.2,57.8 17,57 17,55.2 17.8,54.4 18.2,54.4 18.5,54.1 18.5,52.8 18,52.3 17.7,52.3 16.1,50.7 16.1,48.2 17.7,46.6 17.7,43.8 v20.3,41.2
N$23  (via drill 0.8, 0.8 pad 1.93)
  Top 0.254: v43.2,60.3 42.6,60.9 v33.2,60.9 | v31.55,26.15 31.55,26.45 30.3,27.7 30.3,29.3 29.4,30.2 29.4,34 24.6,38.8 22.9,38.8 21.8,39.9 21.8,42.7 v21.15,43.35 | JP17.1 15.5,51.55 15.5,55.3 v18.4,58.2
  Bottom 0.254: v43.2,60.3 46.3,60.3 47.1,59.5 47.1,58.9 47.39,58.61 47.39,58.31 JP2.3 | U$1.P$24 29.82,33.68 30.3,33.2 30.3,27.4 v31.55,26.15 | v18.4,58.2 18.4,59 22.4,63 27.1,63 27.9,62.2 27.9,61.5 | v21.15,43.35 22.65,43.35 23.3,44 23.3,58.4 24.3,59.4 25.8,59.4 27.9,61.5 | 27.9,61.5 28.3,61.1 33,61.1 v33.2,60.9
N$24  (via drill 0.8, 0.8 pad 1.93)
  Top 0.254: v31.95,28.55 30.2,30.3 30.2,34.5 22.5,42.2 22.5,49.1 20.65,50.95 v20.45,50.95 20.45,51.25 19.4,52.3 17.8,52.3 16.4,50.9 16.4,50 14.3,47.9 JP18.1 | v45.7,58.45 46.15,58 49.5,58 50,58.5 50,60.2 47.3,62.9 26.7,62.9 v25.45,61.65
  Bottom 0.254: U$1.P$22 30.22,34.18 30.9,33.5 30.9,29.6 v31.95,28.55 | JP2.4 45,55.85 45,57.75 v45.7,58.45 | 18.9,55.8 20,56.9 20,58.3 20.15,58.45 20.15,59.25 22.4,61.5 25.3,61.5 v25.45,61.65 | 18.9,55.8 v18.4,55.8 | 18.9,55.8 18.9,55.7 19.6,55 19.6,53.7 20.6,52.7 20.6,51.1 v20.45,50.95
N$25  (via drill 0.8 pad 1.93)
  Top 0.254: v32.31,30.9 31.7,30.9 31,31.6 31,34.8 23.1,42.7 23.1,51.9 22.6,52.4 20.9,52.4 19.35,53.95 | 19.35,53.95 19.8,54.4 19.8,58.8 20,59 20.9,59 21.3,59.4 26,59.4 27.1,60.5 30.2,60.5 31,59.7 31,59 31.4,58.6 36.2,58.6 37.6,60 40.1,60 41,59.1 v41,58.8 | v15.8,45.7 JP19.1 | v16.9,53.4 18.8,53.4 19.35,53.95
  Bottom 0.254: U$1.P$20 30.8,34.68 31.4,34.08 31.42,34.08 31.5,34 31.5,31.4 32,30.9 v32.31,30.9 | JP2.5 42.3,57.8 41.3,58.8 v41,58.8 | v16.9,53.4 16.6,53.4 15.3,52.1 15.3,46.2 v15.8,45.7
N$26  (via drill 0.8, 0.8 pad 1.93)
  Top 0.254: v38.69,58.29 38.4,58 30.7,58 30.1,58.6 30.1,59.5 29.7,59.9 27.4,59.9 26.3,58.8 22.7,58.8 v21.5,57.6 21.5,57.5 20.4,56.4 20.4,54.4 21.7,53.1 23.25,53.1 23.65,52.7 23.65,43.05 25.1,41.6 28.3,41.6 32.3,37.6 v32.3,35.2 | JP20.1 14.15,43.4 16.7,43.4 17.6,44.3 17.6,46.8 16.7,47.7 16.7,49.2 18,50.5 v18.1,50.5
  Bottom 0.254: U$1.P$18 32.28,35.18 v32.3,35.2 | v38.69,58.29 39.8,57.19 39.8,55.73 JP2.6 | v21.5,57.6 21.5,57 20.4,55.9 20.4,54.1 22,52.5 22,50.1 21.4,49.5 19.6,49.5 18.6,50.5 v18.1,50.5
N$27  (via drill 0.8, 0.8 pad 1.93)
  Top 0.254: v28.28,58.42 27.56,57.7 23.6,57.7 23,57.1 23,56.1 v21.9,55 23,53.9 23.8,53.9 24.2,53.5 24.2,43.5 25.3,42.4 31.1,42.4 v31.3,42.6 | JP21.1 15.7,41.3 18.4,44 v18.4,48.2
  Bottom 0.254: U$1.P$16 30.68,35.68 32,37 32,40.7 31.3,41.4 v31.3,42.6 | v28.28,58.42 29.72,58.42 30.2,58.9 36.4,58.9 37.23,58.07 JP2.7 | v21.9,55 22.7,54.2 22.7,49.1 21.8,48.2 v18.4,48.2
N$28
  Top 0.254: U$22.1 11.75,4.05 LED15.A
N$29
  Top 0.254: U$25.1 80.75,3.95 LED17.A
N$30
  Top 0.254: U$26.1 76.15,4.05 LED18.A
N$31
  Top 0.254: U$27.1 71.55,4.05 LED19.A
N$32
  Top 0.254: U$28.1 66.95,4.05 LED20.A
N$33
  Top 0.254: U$23.1 39.35,4.05 LED16.A
N$34
  Top 0.254: U$33.1 34.75,4.05 LED25.A
N$35
  Top 0.254: U$34.1 30.15,4.05 LED26.A
N$36
  Top 0.254: U$35.1 25.55,4.05 LED27.A
N$37
  Top 0.254: U$29.1 62.35,4.05 LED21.A
N$38
  Top 0.254: U$30.1 57.75,4.05 LED22.A
N$39
  Top 0.254: U$31.1 53.15,4.05 LED23.A
N$40
  Top 0.254: U$32.1 48.55,4.05 LED24.A
N$41
  Top 0.254: U$29.2 64.4,5.35 64.4,6.35 JP10.1
N$42
  Top 0.254: U$28.2 69,5.35 69,6.35 JP11.1
N$43
  Top 0.254: U$25.2 82.8,5.35 82.8,6.35 JP14.1
N$44
  Top 0.254: U$26.2 78.2,5.55 78.2,6.35 JP13.1
N$45
  Top 0.254: U$27.2 73.6,5.35 73.6,6.35 JP12.1
N$46
  Top 0.254: U$36.1 20.95,4.05 LED28.A
N$47  (via drill 3.17 pad 6.45)  (3 unrouted)
  other vias: 4.9,59.5 4.9,4.9 90,4.9 90,59.5
N$48  (via drill 0.8)
  Top 0.254: v29.3,43.95 28.35,43 25.5,43 24.95,43.55 24.95,52.75 25.7,53.5 29.55,53.5 v30.3,52.75 30.3,52.6 31.3,51.6 33.9,51.6 35.4,53.1 41.5,53.1 43.5,51.1 70.3,51.1 70.7,50.7 70.7,49.3 71.8,48.2 73.3,48.2 73.8,48.7 73.8,50.6 74.4,51.2 | 74.4,51.2 75,51.8 77.5,51.8 78.2,51.1 78.2,44.7 81.3,41.6 81.3,38 83,36.3 83,31.55 v83.5,31.05 | JP22.1 72.9,52.7 74.4,51.2
  Bottom 0.254: U$1.P$14 30.38,36.18 31.4,37.2 31.4,40.5 29.3,42.6 v29.3,43.95 | v30.3,52.75 31,53.45 31,57.3 31.4,57.7 34.3,57.7 34.7,57.3 34.69,57.29 JP2.8 | U$19.P$2 83.93,30.62 v83.5,31.05
N$49
  Top 0.254: LED10.A U$16.1
N$50
  Top 0.254: U$16.2 JP22.2
N$51  (via drill 0.8)
  Top 0.254: 68.9,51.7 45,51.7 43.05,53.65 33.75,53.65 v33.05,52.95 | 68.9,51.7 71,51.7 72.1,50.6 72.1,49.9 v72.25,49.75 | JP23.1 68.9,51.7
  Bottom 0.254: U$1.P$12 29.98,36.68 30.8,37.5 30.8,40.3 29.3,41.8 29.1,41.8 27.8,43.1 27.8,45.3 26.5,46.6 25.5,46.6 25.5,50.1 25.9,50.5 32,50.5 33.05,51.55 v33.05,52.95 32.15,53.85 JP2.9 | v72.25,49.75 72.25,48.15 72.4,48 72.4,45.2 84.44,33.16 U$19.P$6
N$52
  Top 0.254: LED11.A U$17.1
N$53
  Top 0.254: U$17.2 JP23.2
N$54  (via drill 0.8, 0.8 pad 1.93)
  Top 0.254: v37.55,51.15 35.55,51.15 34.8,50.4 25.85,50.4 25.5,50.05 25.5,45.35 v26.4,44.45 | JP24.1 66.65,53.45 v66.8,53.3
  Bottom 0.254: U$1.P$10 29.58,37.18 30.2,37.8 30.2,40.1 29.1,41.2 28.9,41.2 26.4,43.7 v26.4,44.45 | 66.8,51.15 v37.55,51.15 36,52.7 36,57.9 35.6,58.3 30.8,58.3 29.61,57.11 JP2.10 | 66.8,51.15 73.35,51.15 73.9,50.6 73.9,44.8 84.27,34.43 U$19.P$8 | v66.8,53.3 66.8,51.15
N$55
  Top 0.254: LED12.A U$18.1
N$56
  Top 0.254: U$18.2 JP24.2
N$57  (via drill 0.8, 0.8 pad 1.93)
  Top 0.254: v27.25,51.95 28.2,51 34.2,51 35.75,52.55 40.65,52.55 42.65,50.55 68,50.55 69.65,48.9 v69.65,48.3 69.65,48.15 70.2,47.6 75,47.6 76.2,48.8 v76.2,49.8 | JP25.1 62.75,53.45 v62.8,53.4
  Bottom 0.254: U$1.P$8 29.18,37.68 29.6,38.1 29.6,39.8 28.8,40.6 28.6,40.6 28.6,40.7 26.4,42.9 25.6,42.9 24.95,43.55 24.95,51.05 25.5,51.6 26.9,51.6 v27.25,51.95 | 27.09,52.11 v27.25,51.95 | JP2.11 27.07,52.13 v27.25,51.95 | v76.2,49.8 73.3,52.7 70.8,52.7 68.1,55.4 63.4,55.4 62.8,54.8 v62.8,53.4 | U$19.P$4 84.71,31.89 69.65,46.95 v69.65,48.3
N$58
  Top 0.254: LED13.A U$20.1
N$59
  Top 0.254: U$20.2 JP25.2
N$60  (via drill 0.8 pad 1.93)
  Top 0.254: v54.5,60.6 55.1,60 55.1,53.9 55.6,53.4 56.85,53.4 JP26.1
  Bottom 0.254: U$1.P$6 28.88,38.18 29,38.3 29,39.6 28.8,39.8 28.2,39.8 27.7,40.3 27.7,40.8 26.2,42.3 25,42.3 24.3,43 24.3,55.45 24.53,55.68 JP2.12 24.53,57.33 27.3,60.1 30.4,60.1 31,59.5 37,59.5 38,60.5 40.7,60.5 42,61.8 54.5,61.8 | 54.5,61.8 63.3,61.8 72.32,61.8 76.12,61.8 U$9.P$2 78.42,59.5 78.42,56.24 80.96,53.7 81.33,53.33 82.05,52.61 82.05,37.95 84.3,35.7 U$19.P$10 | v54.5,60.6 54.5,61.8
N$61
  Top 0.254: LED14.A U$21.1
N$62
  Top 0.254: U$21.2 JP26.2
N$63
  Top 0.254: U$37.1 16.35,4.05 LED29.A
N$64
  Top 0.254: U$22.2 13.8,5.35 13.8,6.35 JP27.1
N$65
  Top 0.254: U$37.2 18.4,5.35 18.4,6.35 JP28.1
N$66
  Top 0.254: U$36.2 23,5.35 23,6.35 JP29.1
N$67
  Top 0.254: U$35.2 27.6,5.35 27.6,6.35 JP30.1
N$68
  Top 0.254: U$34.2 32.2,5.35 32.2,6.35 JP31.1
N$69
  Top 0.254: U$33.2 36.8,5.35 36.8,6.35 JP32.1
N$70
  Top 0.254: U$23.2 41.4,5.35 41.4,6.35 JP33.1
PTD1  (via drill 0.8)
  Top 0.254: v8.9,30.9 8.3,30.3 5.6,30.3 5,29.7 5,28.2 5.6,27.6 8.8,27.6 9.5,26.9 9.5,25.9 10.2,25.2 15.5,25.2 16.9,26.6 19.4,26.6 20.3,25.7 20.3,25.1 18.6,23.4 18.6,21.7 22,18.3 22,17.1 24,15.1 34.1,15.1 34.7,14.5 37.1,14.5 39.3,16.7 65.5,16.7 66.8,15.4 66.8,14.3 v67.15,13.95 68.9,12.2 72.9,12.2 76.25,8.85 79.55,8.85 81.35,7.05 JP14.2
  Bottom 0.254: U$1.P$5 17.52,38.18 16.5,39.2 16.5,40.3 15.8,41 12.1,41 9.1,41 8.4,40.3 8.4,39.9 9.1,39.2 9.1,33.1 8.9,32.9 v8.9,30.9 | JP1.1 63.7,10.9 66.75,13.95 v67.15,13.95
PTD2  (via drill 0.8, 0.8 pad 1.93)
  Top 0.254: v64.6,15.3 64.6,14.4 68.1,10.9 70.5,10.9 71.8,10.9 75.6,7.1 76.55,7.1 JP13.2 76.75,7.15 | v9.15,9.55 9.15,18.95 8.9,19.2 5.6,19.2 2.2,22.6 2.2,32.2 4.2,34.2 4.2,38.9 4.9,39.6 8.7,39.6 9.2,39.1 9.4,38.9 10.75,38.9 v10.95,38.7
  Bottom 0.254: U$1.P$7 15.17,37.68 13.95,38.9 11.15,38.9 v10.95,38.7 | v9.15,9.55 9.15,9.25 15.6,2.8 57.7,2.8 60.41,5.51 JP1.2 60.41,13.11 60.7,13.4 62.2,13.4 64.1,15.3 v64.6,15.3
PTD3  (via drill 0.8, 0.8 pad 1.93)
  Top 0.254: v3.8,30.3 4.4,30.9 6.9,30.9 8.3,32.3 9.7,32.3 10.3,32.9 11.15,33.75 v11.15,36.05 | v61.5,15.2 62.7,14 64,14 67.8,10.2 69.8,10.2 72.15,7.85 JP12.2
  Bottom 0.254: U$1.P$9 11.88,37.18 11.15,36.45 v11.15,36.05 | v3.8,30.3 3.8,20.5 5.3,19 8.3,19 9.2,18.1 9.2,11.6 17.4,3.4 56.3,3.4 57.87,4.97 JP1.3 57.87,11.67 61.4,15.2 v61.5,15.2
PTD4  (via drill 0.8 pad 1.93)
  Top 0.254: v59,15 60.3,13.7 60.7,13.7 61,13.4 63.8,13.4 67.55,9.65 JP11.2
  Bottom 0.254: U$1.P$11 14.08,36.68 10.3,32.9 10.3,28.2 9.7,27.6 5.3,27.6 4.7,27 4.7,20.9 5.8,19.8 9.7,19.8 10.2,19.3 10.2,11.5 17.7,4 55,4 55.33,4.33 JP1.4 55.33,11.83 55.63,11.83 56.8,13 58,13 58.8,13.8 58.8,14.8 v59,15
PTD5  (via drill 0.8 pad 1.93)
  Top 0.254: v56.5,14.9 57.1,14.3 57.1,13.6 57.6,13.1 60.4,13.1 60.7,12.8 63.5,12.8 65,11.3 65,9.9 63.4,8.3 63,7.9 63,6.95 JP10.2
  Bottom 0.254: U$1.P$13 14.88,36.18 13.1,34.4 13.1,24.2 11,22.1 11,11.8 18.2,4.6 51.6,4.6 52.79,5.79 JP1.5 52.79,12.29 53.5,13 55.5,13 56.3,13.8 56.3,14.7 v56.5,14.9
PTD6  (via drill 0.8 pad 1.93)
  Top 0.254: v53.8,14.9 53.9,14.8 53.9,13.6 54.5,13 56.2,13 56.6,12.6 56.6,9.3 58.3,7.6 58.3,6.95 JP9.2
  Bottom 0.254: U$1.P$15 15.68,35.68 13.65,33.65 13.65,23.85 11.6,21.8 11.6,12.2 18.6,5.2 48.3,5.2 50.25,7.15 JP1.6 50.25,12.25 50.9,12.9 52.1,12.9 52.8,13.6 52.8,13.9 v53.8,14.9
PTD7  (via drill 0.8 pad 1.93)
  Top 0.254: v51.3,14.8 51.5,14.6 51.5,9.2 51.5,9.15 JP8.2
  Bottom 0.254: U$1.P$17 16.48,35.18 14.2,32.9 14.2,23.5 12.2,21.5 12.2,12.7 19.1,5.8 47.1,5.8 47.71,6.41 JP1.7 | JP1.7 | JP1.7 47.71,12.01 48.5,12.8 49.5,12.8 50.2,13.5 50.7,13.5 50.9,13.7 50.9,14.4 v51.3,14.8
PTE0  (via drill 0.8 pad 1.93)
  Top 0.254: JP6.2 49.15,8.95 49,9.1 v49,14.9
  Bottom 0.254: U$1.P$19 17.33,34.68 14.75,32.1 14.75,23.15 12.8,21.2 12.8,13.1 19.4,6.5 43.6,6.5 45.17,8.07 | 45.17,8.07 45.2,8.1 | 45.17,8.07 JP1.8 45.2,10.93 45.2,12.5 45.6,12.9 47.1,12.9 49,14.8 v49,14.9
PTE1  (via drill 0.8 pad 1.93)
  Top 0.254: v46.4,14.9 46.4,8.9 46.4,8.8 46,8.4 45,8.4 44.6,8 44.6,6.95 JP7.2 44.55,7.05
  Bottom 0.254: U$1.P$21 17.68,34.18 15.3,31.8 15.3,22.8 13.4,20.9 13.4,13.5 19.7,7.2 41.7,7.2 42.63,8.13 JP1.9 | 42.7,10.97 JP1.9 | JP1.9 42.63,12.33 43.4,13.1 44.7,13.1 46.4,14.8 v46.4,14.9
PTE2  (via drill 0.8 pad 1.93)
  Top 0.254: v43.8,14.9 43.9,14.8 43.9,9 43.4,8.5 41,8.5 40.4,8.5 39.9,8 39.9,6.95 JP33.2
  Bottom 0.254: U$1.P$23 18.18,33.68 15.85,31.35 15.85,22.55 14,20.7 14,14.1 20.3,7.8 37.9,7.8 40.09,9.99 JP1.10 | 40,10.99 JP1.10 | JP1.10 40.09,11.19 v43.8,14.9
PTE3  (via drill 0.8 pad 1.93)
  Top 0.254: v41.3,14.9 41.1,14.7 41.1,13.5 40.6,13 39.7,13 38.8,12.1 38.8,9.1 38.4,8.7 37.3,8.7 36.7,8.1 35.7,8.1 35.4,7.8 35.4,6.95 JP32.2
  Bottom 0.254: U$1.P$25 18.68,33.18 16.45,30.95 16.45,22.35 14.6,20.5 14.6,14.4 20.6,8.4 36.5,8.4 37.55,9.45 JP1.11 37.55,11.35 38.5,12.3 39,12.3 39.7,13 40.7,13 41.1,13.4 41.1,14.7 v41.3,14.9
PTE4  (via drill 0.8 pad 1.93)
  Top 0.254: v38.8,14.1 38,13.3 36.6,13.3 36.3,13 36.3,9.3 36.3,9.2 35.8,8.7 34.3,8.7 33.6,8 30.9,8 30.8,7.9 30.8,6.95 JP31.2
  Bottom 0.254: U$1.P$27 19.13,32.68 17.1,30.65 17.1,22.1 15.3,20.3 15.3,14.7 21,9 34.8,9 35.01,9.21 JP1.12 35.01,12.71 35.6,13.3 38,13.3 v38.8,14.1
PTE16  (via drill 0.8)
  Top 0.254: v18.55,25.25 17.9,24.6 17.9,21.5 21.4,18 21.4,16.7 23.55,14.55 32.55,14.55 v33.45,13.65 33.8,13.3 33.8,9.1 33.4,8.7 27.1,8.7 26.9,8.5 26.2,7.8 26.2,6.95 JP30.2
  Bottom 0.254: U$1.P$29 19.68,32.18 17.85,30.35 17.85,25.95 v18.55,25.25 | JP1.13 32.47,12.67 v33.45,13.65
PTE17  (via drill 0.8)
  Top 0.254: v28.65,13.2 27.9,13.2 27.3,13.8 23,13.8 | v17.35,19.8 17.42,19.73 18.8,19.73 20.5,18.03 20.5,16.3 23,13.8 | JP29.2 21.55,9.75 22.8,11 22.8,13.6 23,13.8
  Bottom 0.254: U$1.P$31 20.18,31.68 18.4,29.9 18.4,27.9 19.3,27 19.65,27 22.6,24.05 22.6,21.2 22,20.6 20.2,20.6 19.3,19.7 17.45,19.7 v17.35,19.8 | JP1.14 29.93,11.92 v28.65,13.2
PTE18  (via drill 0.8)
  Top 0.254: v18.4,17.5 18.4,15.75 v21.2,12.95 16.95,8.7 JP28.2
  Bottom 0.254: U$1.P$33 20.68,31.18 19.4,29.9 19.4,28.1 23.5,24 23.5,21.2 22.3,20 20.9,20 v18.4,17.5 | JP1.15 27.39,11.91 26.35,12.95 v21.2,12.95
PTE19  (via drill 0.8 pad 1.93)
  Top 0.254: JP27.2 12.35,10.95 v16.9,15.5
  Bottom 0.254: U$1.P$35 21.08,30.68 20.3,29.9 20.3,28 24.6,23.7 24.6,21.3 20.6,17.3 20.6,16.7 18.3,14.4 | JP1.16 20.4,10.9 18.3,13 18.3,14.4 | v16.9,15.5 17.2,15.5 18.3,14.4
V+  (via drill 0.8)
  Top 0.254: C1.1 81.55,35.85 82,35.4 82,30.52 81.59,30.11 | U$11.2 U$10.2 U$12.2 77.1,17.2 77.2,17.1
  Top 1.27: IC1.3 81.59,30.11 84,27.7 84,25.5 82.7,24.2 v81.05,24.2 80.1,23.25 80.1,21.3 77.2,18.4 77.2,17.1 77.2,14.8 76.1,13.7 70.1,13.7 66,17.8 25.1,17.8 24.7,18.2 24.7,24.6 24.5,24.8 24.5,25.4 20.4,29.5 12.9,29.5 12.4,29 6.4,29 v6.35,28.95
  Bottom 1.27: JP5.3 JP5.2 JP5.1 | JP5.1 6.9,36 6.5,35.6 | U$3.P$1 80.27,16.23 79.5,17 79.5,22.65 v81.05,24.2 | v6.35,28.95 6.35,32.81 JP5.1

### Text on the board
tPlace: !RESET | PTA0 | PTA1 | PTA2 | PTA3 | PTA4 | PTA18 | PTA19 | PTC4 | PTC5 | PTC6 | PTC7 | RESET | POWER | KW2DEV.PCB.v1.1 | VIN | JTAG | R.S. 7/16/2015 | +3.3V | - | + | GND | PTE19 | PTE18 | PTE17 | PTE16 | PTE4 | PTE3 | PTE2 | PTE1 | PTE0 | PTD7 | PTD6 | PTD5 | PTD4 | PTD3 | PTD2 | PTD1 | 4.5V - 20V / (ABS MAX)